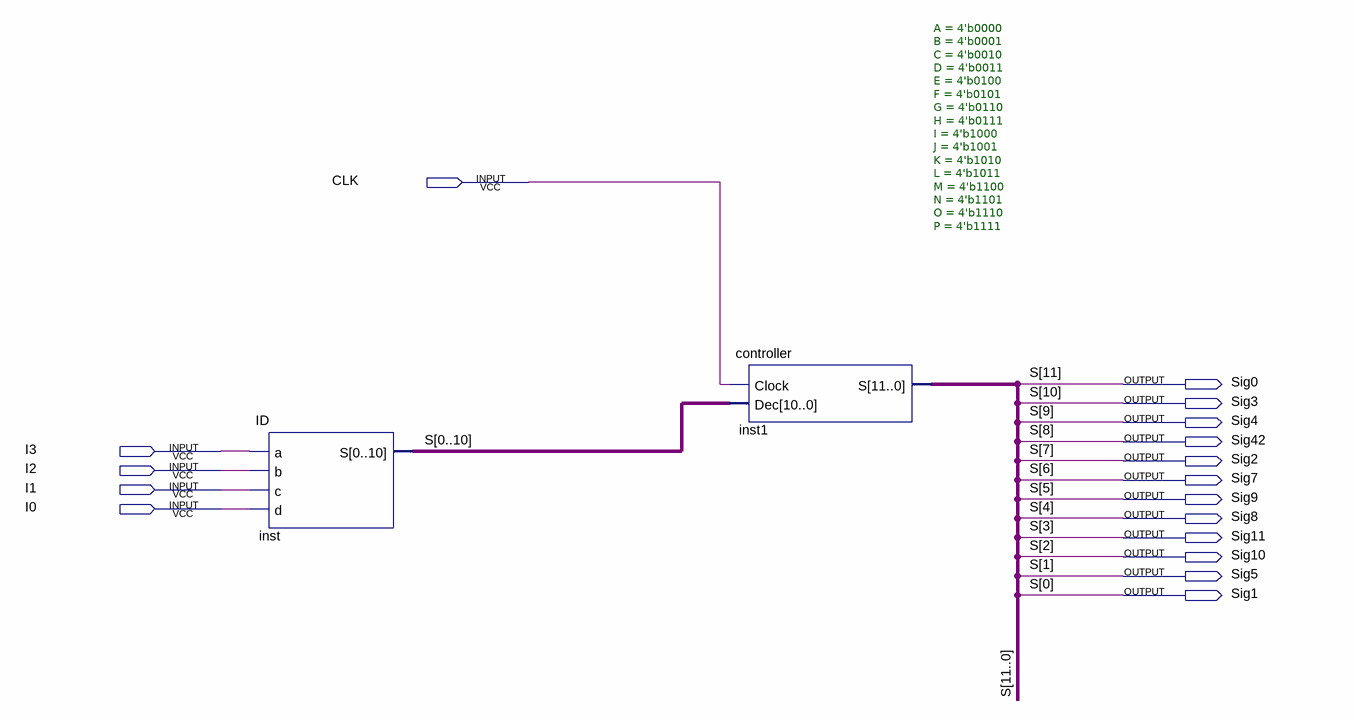
[diagram p0: schematic sheet]
// Quartus schematic PartBCon.bdf as structural Verilog: 2 symbols, 17 pins
module PartBCon (
  input  CLK,
  input  I3,
  input  I2,
  input  I1,
  input  I0,
  output Sig0,
  output Sig3,
  output Sig4,
  output Sig42,
  output Sig2,
  output Sig7,
  output Sig9,
  output Sig8,
  output Sig11,
  output Sig10,
  output Sig5,
  output Sig1
);

  ID inst (.a(I3), .b(I2), .c(I1), .d(I0), .S({Sig1, Sig5, Sig10, Sig11, Sig8, Sig9, Sig7, Sig2, Sig42, Sig4, Sig3}));
  controller #(.A(4'b0000), .B(4'b0001), .C(4'b0010), .D(4'b0011), .E(4'b0100), .F(4'b0101), .G(4'b0110), .H(4'b0111), .I(4'b1000), .J(4'b1001), .K(4'b1010), .L(4'b1011), .M(4'b1100), .N(4'b1101), .O(4'b1110), .P(4'b1111)) inst1 (
    .Clock(CLK), .Dec({Sig1, Sig5, Sig10, Sig11, Sig8, Sig9, Sig7, Sig2, Sig42, Sig4, Sig3}),
    .S({Sig0, Sig3, Sig4, Sig42, Sig2, Sig7, Sig9, Sig8, Sig11, Sig10, Sig5, Sig1}));

  // Other names for the same wires on the sheet: S[11:0] = {Sig0, Sig3, Sig4, Sig42, Sig2, Sig7, Sig9, Sig8, Sig11, Sig10, Sig5, Sig1}
endmodule
